# EAGLE design led-board (EAGLE 9.6.2)
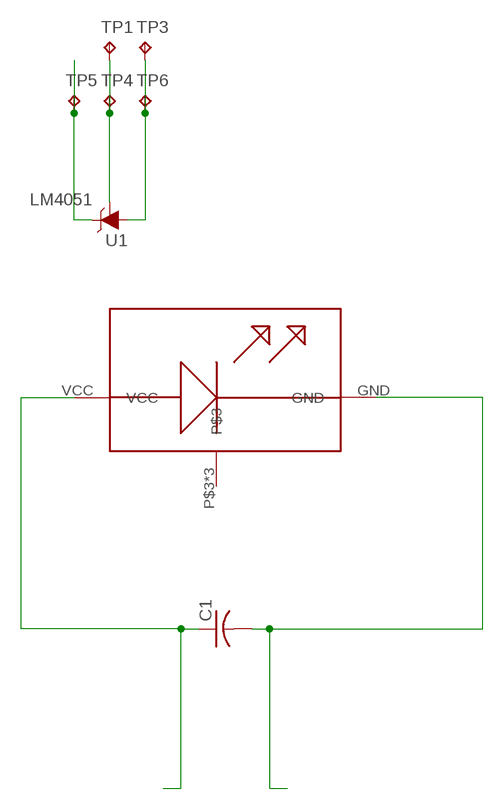
[diagram p0: schematic, sheet 1]

## Parts
C1  C-USC0805  [C0805]
TP1  TPTP20SQ  [TP20SQ]
TP3  TPTP20SQ  [TP20SQ]
TP4  TPTP20SQ  [TP20SQ]
TP5  TPTP20SQ  [TP20SQ]
TP6  TPTP20SQ  [TP20SQ]
U1  LM4051  [SOT23-3]
U$3  XHP50.3  [XHP50.3]

## Nets
N$1: C1.1 U$3.VCC
N$2: C1.2 U$3.GND
N$6: TP1.TP TP4.TP U1.1(ADJ)
N$7: TP5.TP U1.2(C)
N$8: TP3.TP TP6.TP U1.3(A)
Unconnected: U$3.P$3 U$3.P$4 U$3.P$5

## Library data of the parts
C1 = rcl:C-US: CAPACITOR, American symbol; SPICEPREFIX: C
TP1 TP3-TP6 = testpad:TP: Test pad
U1 = SparkFun-DiscreteSemi:LM4051: Adjustable Shunt Voltage Reference SOT-23 package without need for external capacitor. Adjustable from 1.24V to 10V. 60µA to 12mA SparkFun Products: SparkFun SparkPunk Sound Kit <https://www.sparkfun.com/products/11177> SparkFun ESP8266 Thing <https://www.sparkfun.com/products/13231>; PROD_ID: IC-13134
U$3 = shirnschall:XHP50.3

## Net classes
0 default: clearance 0.406 mm

## Board
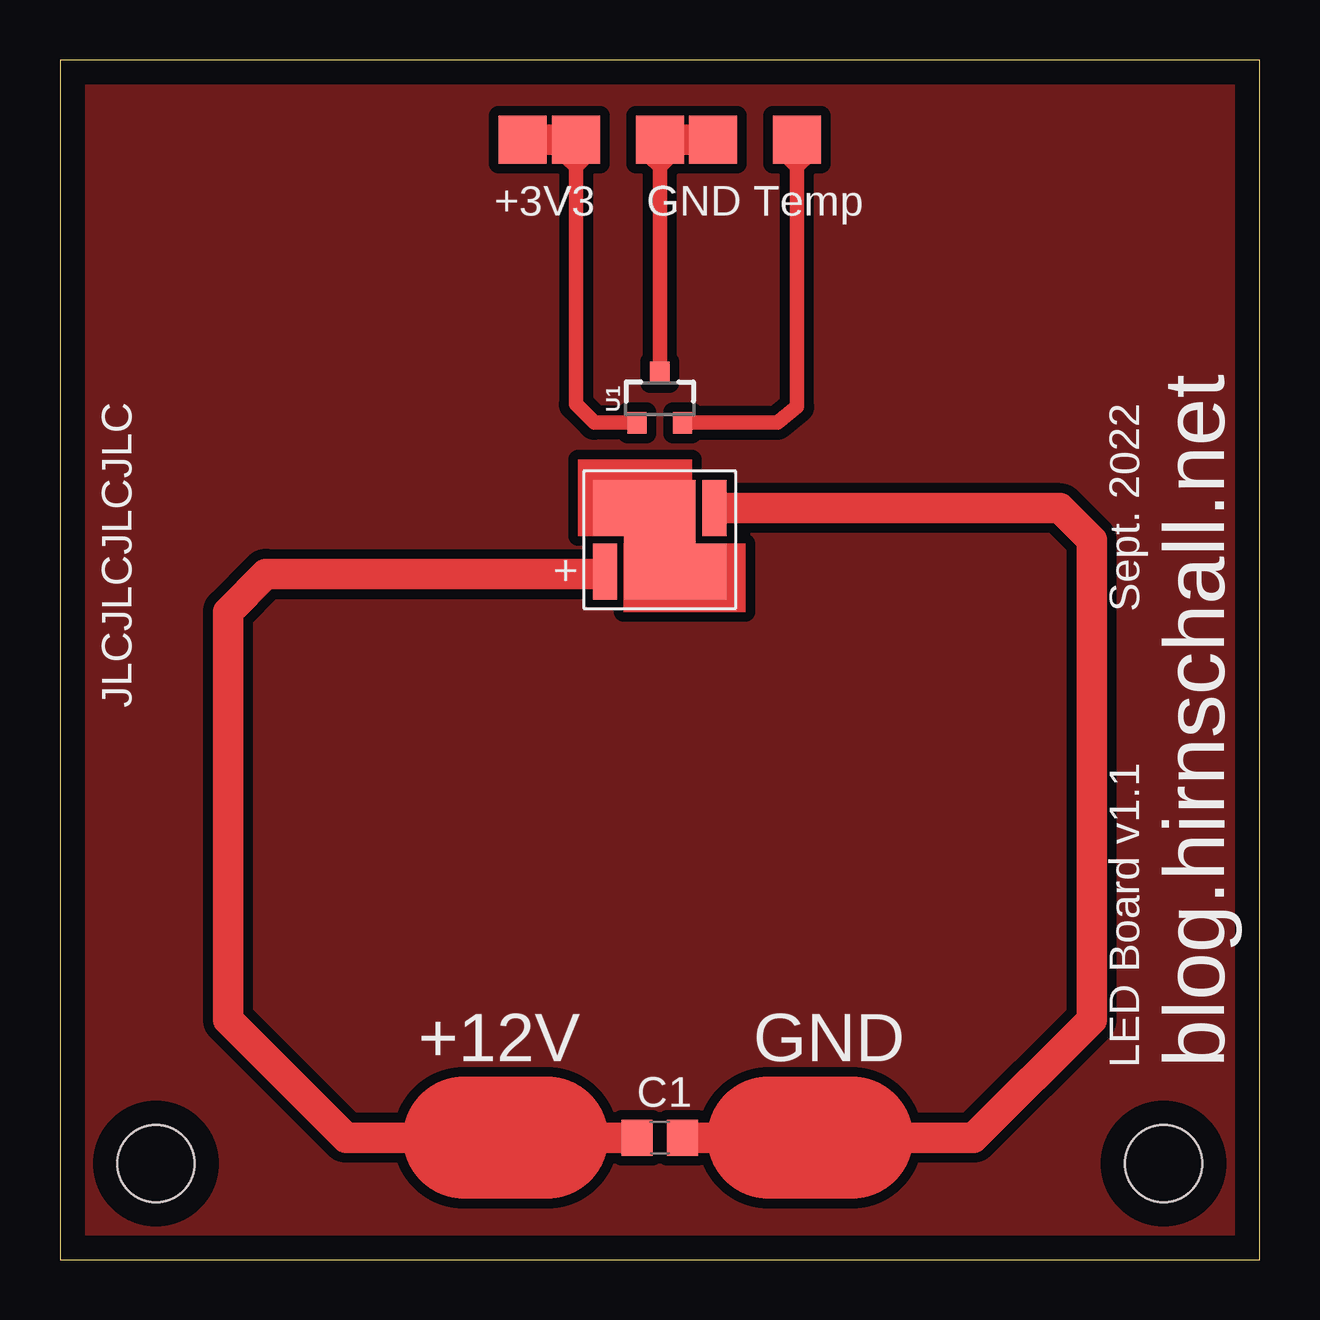
[diagram p1: board, top side]

Size 50 x 50 mm. Coordinates in mm from the lower left corner, seen from the top.
Outline: 0,0 50,0 50,50 0,50 0,0
Copper layers (1*16): Top 0.035mm / dielectric 1.5mm / Bottom 0.035mm
Design rules "default": minimum track width 6mil, minimum drill 0.35mm, track to track 6mil, track to pad 6mil, pad to pad 6mil, via to via 6mil, smd to smd 6mil, copper to edge 40mil, drill to drill 6mil, minimum pad ring 10mil, minimum via ring 8mil, stop-mask expansion 4mil, vias tented up to drill 0mil, thermal gap 10mil
Holes 3.2 mm at 4,4 46,4

### Footprints (pad centres in the part's own frame; a part is rotated, then mirrored left to right if it is on the bottom)
C0805 = smd 1.3 x 1.5: 1 -0.95,0; 2 0.95,0
TP20SQ = smd 2 x 2: TP 0,0
SOT23-3 = smd 0.8 x 0.9: 1 -0.95,-1; 2 0.95,-1; 3 0,1.1
XHP50.3 = smd 1 x 2.34: GND 2.29,1.32; VCC -2.29,-1.32 | smd 2.98 x 4.98: P$3 0,0 | smd 1.3 x 2.34: P$4 -2.14,1.32; P$5 2.14,-1.32

### Placement (x,y rotation side)
C1  25,5.08 0 top
TP1  19.28,46.67 0 top
TP3  27.22,46.67 0 top
TP4  21.5,46.67 0 top
TP5  30.72,46.67 0 top
TP6  25,46.67 0 top
U1  25,35.88 0 top
U$3  25,30 0 top

### Tracks (layer width: path | path; a pad name or v marks a point on that pad's centre or on a via)
N$1
  Top 0.406: U$3.VCC 22.61,28.57 22.23,28.57
  Top 1.27: 22.23,28.57 8.57,28.57 7,27 7,10 11.92,5.08 16.83,5.08 | C1.1 20.32,5.08
  Top 5.08: 20.32,5.08 16.83,5.08
N$2
  Top 0.406: U$3.GND 27.68,31.32 30.68,31.32 31,31
  Top 1.016: 29.53,5.08 29.53,4.45 29.84,4.13 | 33.34,5.08 33.02,5.08
  Top 1.27: C1.2 29.41,5.08 29.84,4.64 29.84,4.13 | 27.68,31.32 41.68,31.32 43,30 43,10 38.08,5.08 33.34,5.08
  Top 5.08: 33.02,5.08 29.53,5.08
N$6
  Top 0.406: 20.95,46.04 20.95,45.95 21.5,45.4 21.91,45.81 21.91,46.04
  Top 0.61: U1.1 22.27,34.88 21.5,35.65 21.5,45.4 TP4.TP
  Top 1.27: TP4.TP TP1.TP
N$7
  Top 0.406: 30.16,46.04 30.16,45.96 30.72,45.4 31.11,45.8 31.11,46.04
  Top 0.61: TP5.TP 30.72,45.4 30.72,35.55 29.9,34.88 U1.2
N$8
  Top 0.406: 25,45.4 24.45,45.95 24.45,46.04 25,45.48 25,45.4 | 25,45.4 25.4,45.8 25.4,46.04
  Top 0.61: U1.3 25,45.4 TP6.TP
  Top 1.27: TP3.TP TP6.TP
P$3
  pour Top: 0.32,49.53 0.32,0.32 49.85,0.32 49.85,49.85 0.32,49.85
(copper drawn outside any net)
  shapes: Top area x2

### Text on the board
tNames: +3V3 | GND | Temp | Sept. 2022 | JLCJLCJLCJLC | +12V | GND | LED Board v1.1 | blog.hirnschall.net